# EAGLE design MRCS-4-Station-Tel-Control (EAGLE 7.7.0)
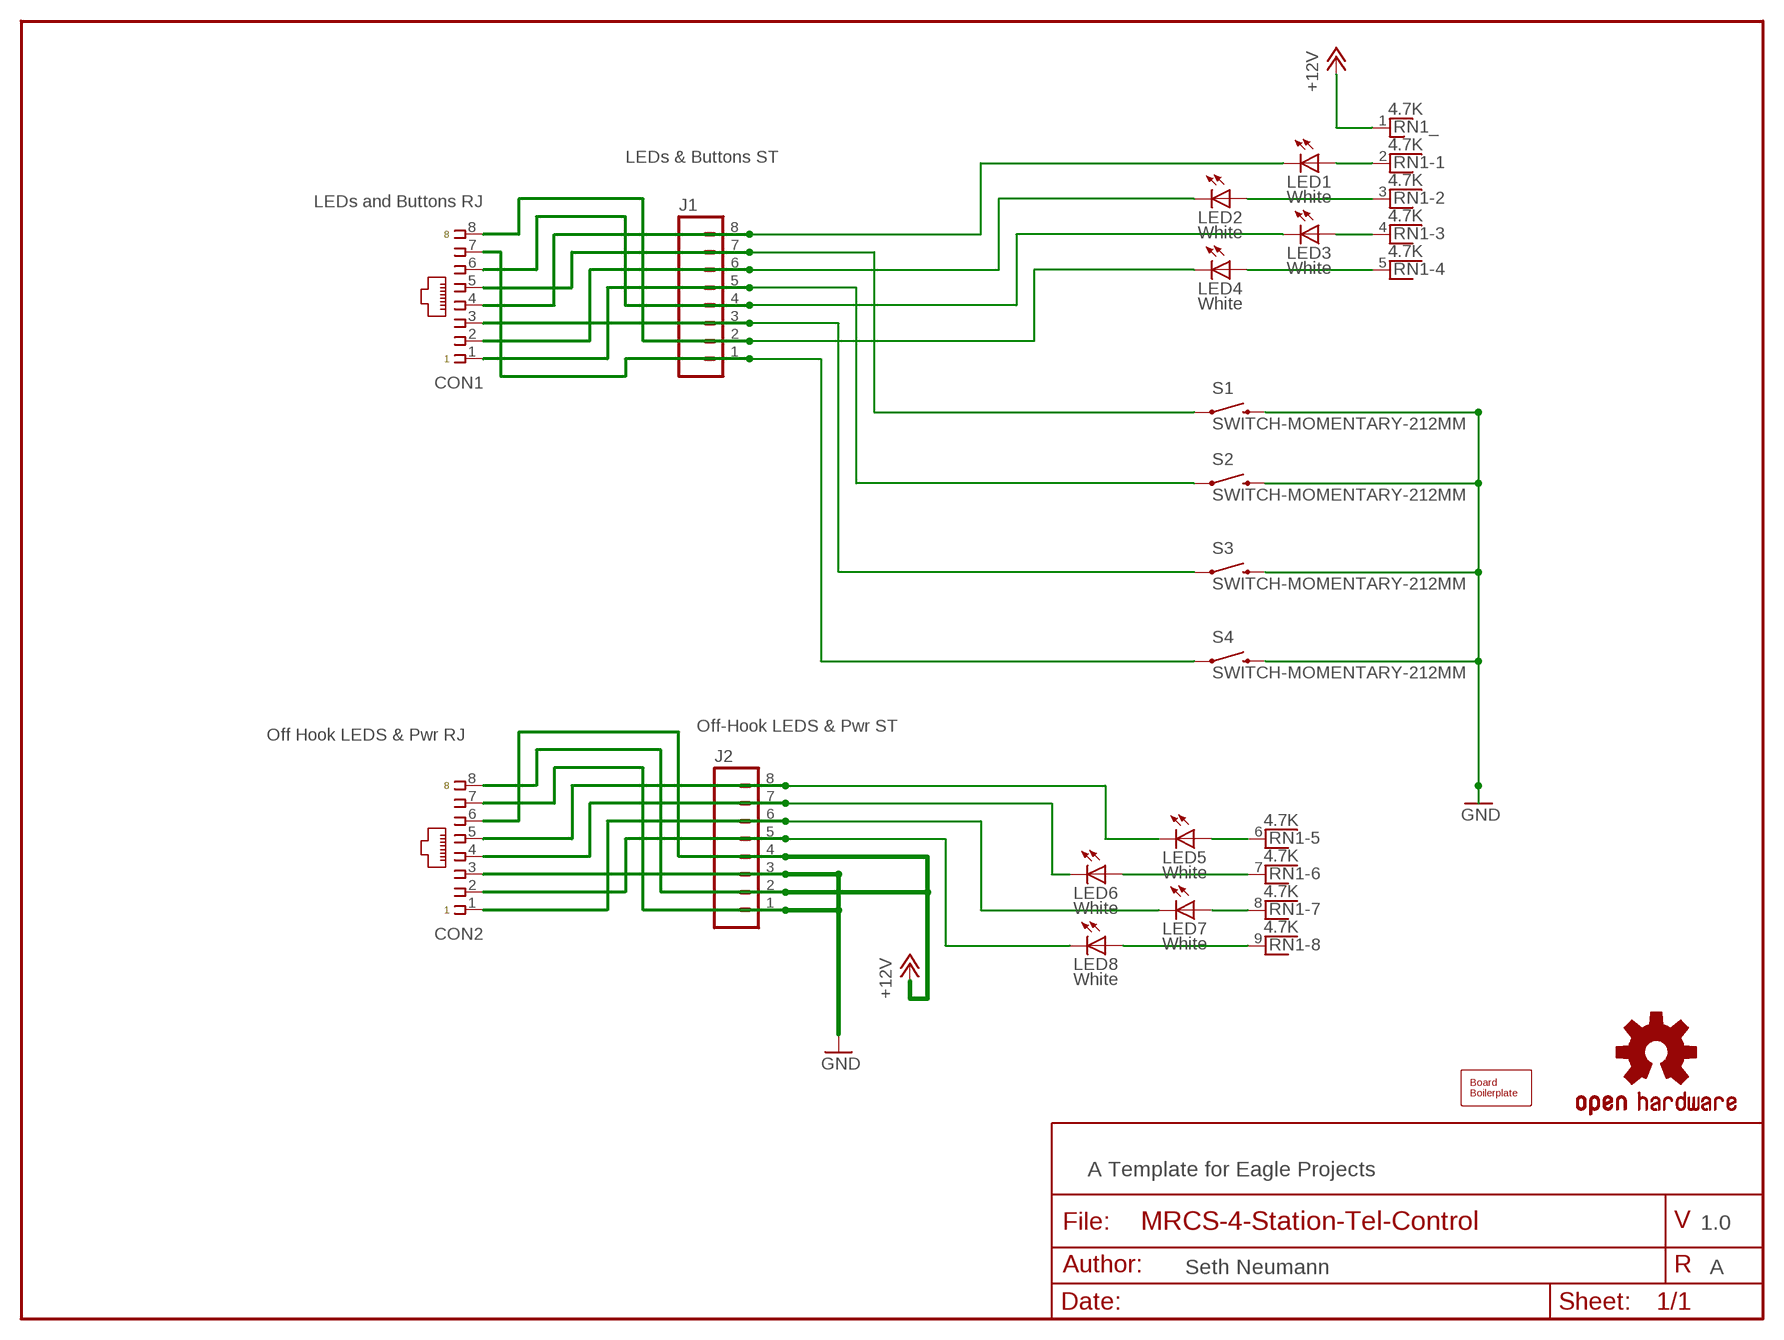
[diagram p0: schematic, sheet 1]

## Parts
BOARD1  BOARD80X100  [BOARD-DINRAIL-3.17INX10CM]
CON1  LEDs and Buttons RJ  CONNECTOR-RJ45-FRONT  [RJ45-NO-SHIELD]
CON2  Off Hook LEDS & Pwr RJ  CONNECTOR-RJ45-FRONT  [RJ45-NO-SHIELD]
J1  LEDs & Buttons ST  CONNECTOR-M08LOCK  [1X08_LOCK]
J2  Off-Hook LEDS & Pwr ST  CONNECTOR-M08LOCK  [1X08_LOCK]
LED1  White  LEDLED5MM  [LED5MM]
LED2  White  LEDLED5MM  [LED5MM]
LED3  White  LEDLED5MM  [LED5MM]
LED4  White  LEDLED5MM  [LED5MM]
LED5  White  LEDLED5MM  [LED5MM]
LED6  White  LEDLED5MM  [LED5MM]
LED7  White  LEDLED5MM  [LED5MM]
LED8  White  LEDLED5MM  [LED5MM]
OSHW1  DOC-OSHW-LOGO-M  [OSHW-LOGO-M]
RN1  4.7K  RNX8  [RN-9]
S1  SWITCH-MOMENTARY-212MM  [TACTILE-PTH-12MM]
S2  SWITCH-MOMENTARY-212MM  [TACTILE-PTH-12MM]
S3  SWITCH-MOMENTARY-212MM  [TACTILE-PTH-12MM]
S4  SWITCH-MOMENTARY-212MM  [TACTILE-PTH-12MM]

## Nets
+12V: CON2.6 CON2.8 J2.2 J2.4 RN1.1
GND: CON2.3 CON2.7 J2.1 J2.3 S1.3 S2.3 S3.3 S4.3
N$1: LED1.A RN1.2
N$2: LED2.A RN1.3
N$3: LED3.A RN1.4
N$4: LED4.A RN1.5
N$5: LED5.A RN1.6
N$6: LED6.A RN1.7
N$7: LED7.A RN1.8
N$8: LED8.A RN1.9
N$9: CON1.4 J1.8 LED1.K(C)
N$12: CON1.1 J1.5 S2.1
N$13: CON1.5 J1.7 S1.1
N$14: CON1.3 J1.3 S3.1
N$15: CON1.6 J1.4 LED3.K(C)
N$16: CON1.7 J1.1 S4.1
N$17: CON1.8 J1.2 LED4.K(C)
N$18: CON1.2 J1.6 LED2.K(C)
N$20: CON2.5 J2.8 LED5.K(C)
N$21: CON2.4 J2.7 LED6.K(C)
N$22: CON2.1 J2.6 LED7.K(C)
N$23: CON2.2 J2.5 LED8.K(C)

## Notes on the sheet
- A Template for Eagle Projects
- 1.0
- Seth Neumann | A

## Library data of the parts
BOARD1 = SPCoast:BOARD
CON1 CON2 = SPCoast:CONNECTOR-RJ45: Tyco CORCOM Modular RJ Jacks No Shield; AMP: 520151-4; OPL: none
J1 J2 = SPCoast:CONNECTOR-M08: Header 8 Standard 8-pin 0.1" header. Use with straight break away headers (SKU : PRT-00116), right angle break away headers (PRT-00553), swiss pins (PRT-00743), machine pins (PRT-00117), and female headers (PRT-00115).
LED1-LED8 = SPCoast:LED*
OSHW1 = SPCoast:DOC-OSHW-LOGO-: Open Source Hardware Logo This logo indicates the piece of hardware it is found on incorporates a OSHW license and/or adheres to the definition of open source hardware http://freedomdefined.org/OSHW Creative Commons - Attribution - ShareAlike 3.0
RN1 = resistor-net:RNX8: RESISTOR NETWORK; OC_FARNELL: unknown; OC_NEWARK: unknown
S1-S4 = SparkFun-Electromechanical:SWITCH-MOMENTARY-2: Various NO switches- pushbuttons, reed, etc; PROD_ID: SWCH-09185

## Board
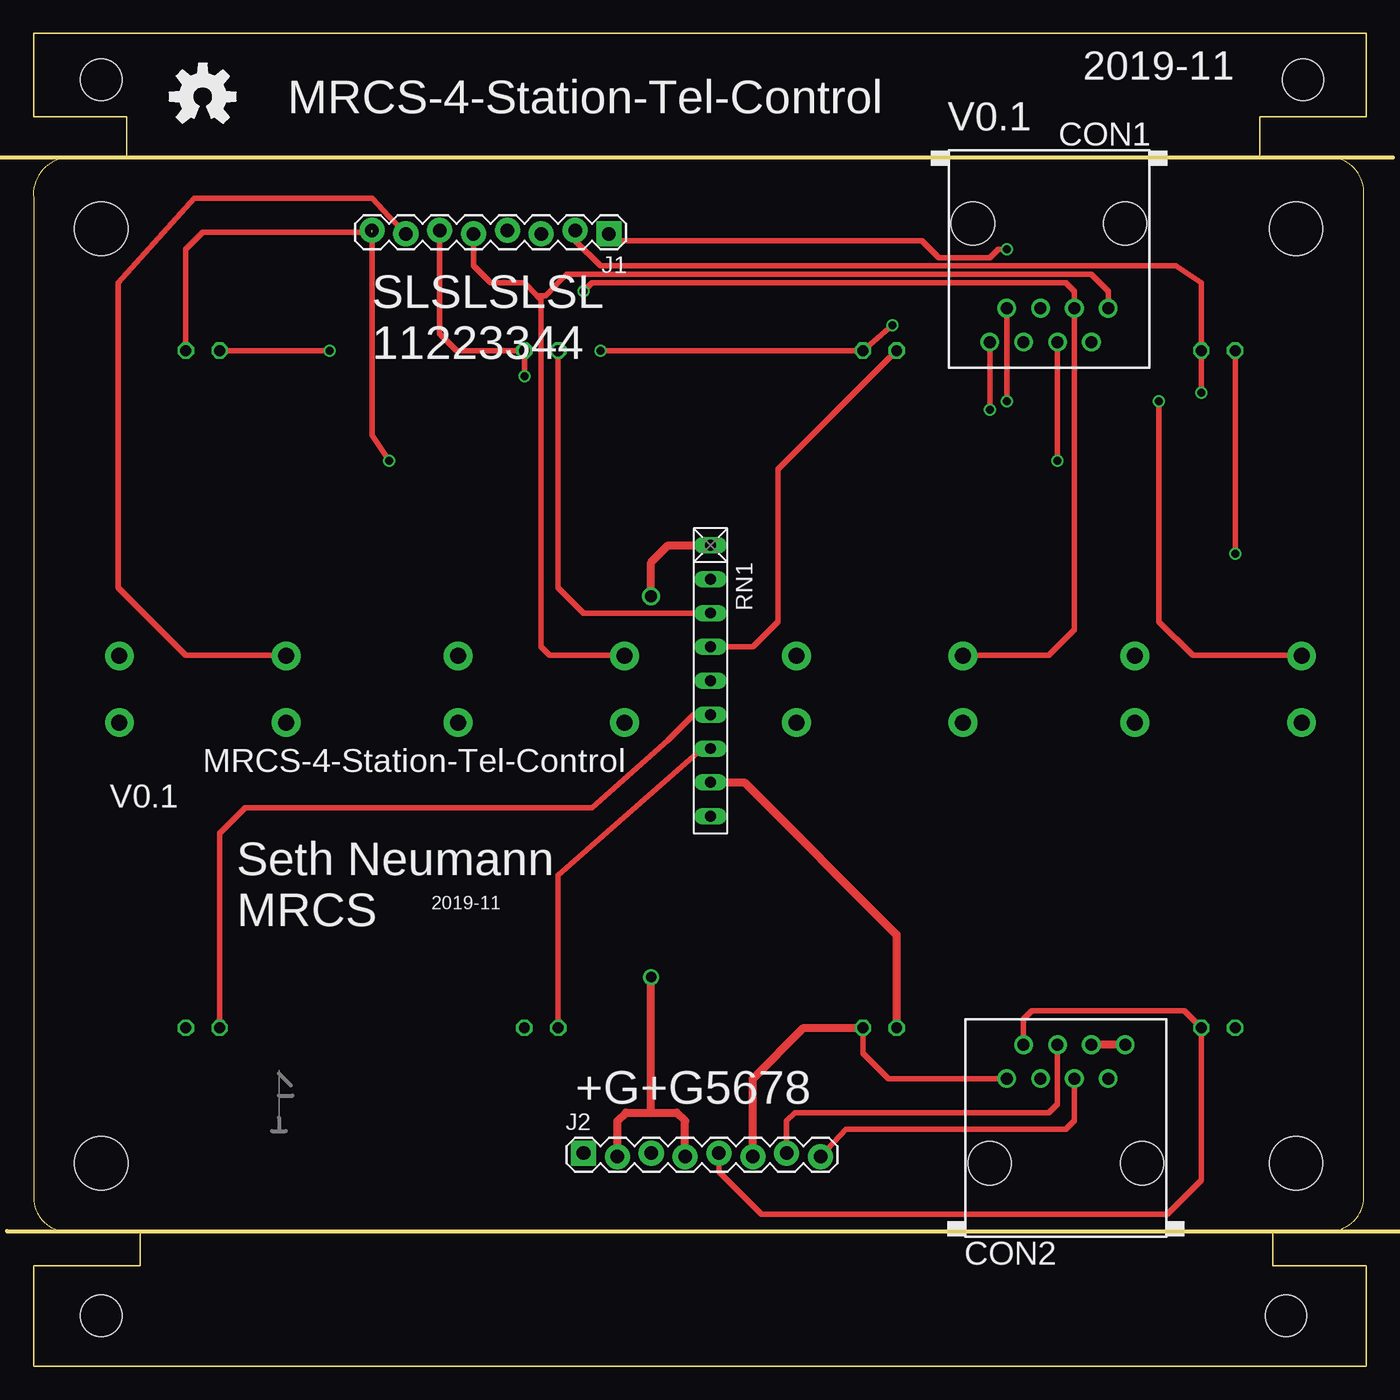
[diagram p1: board, top side]
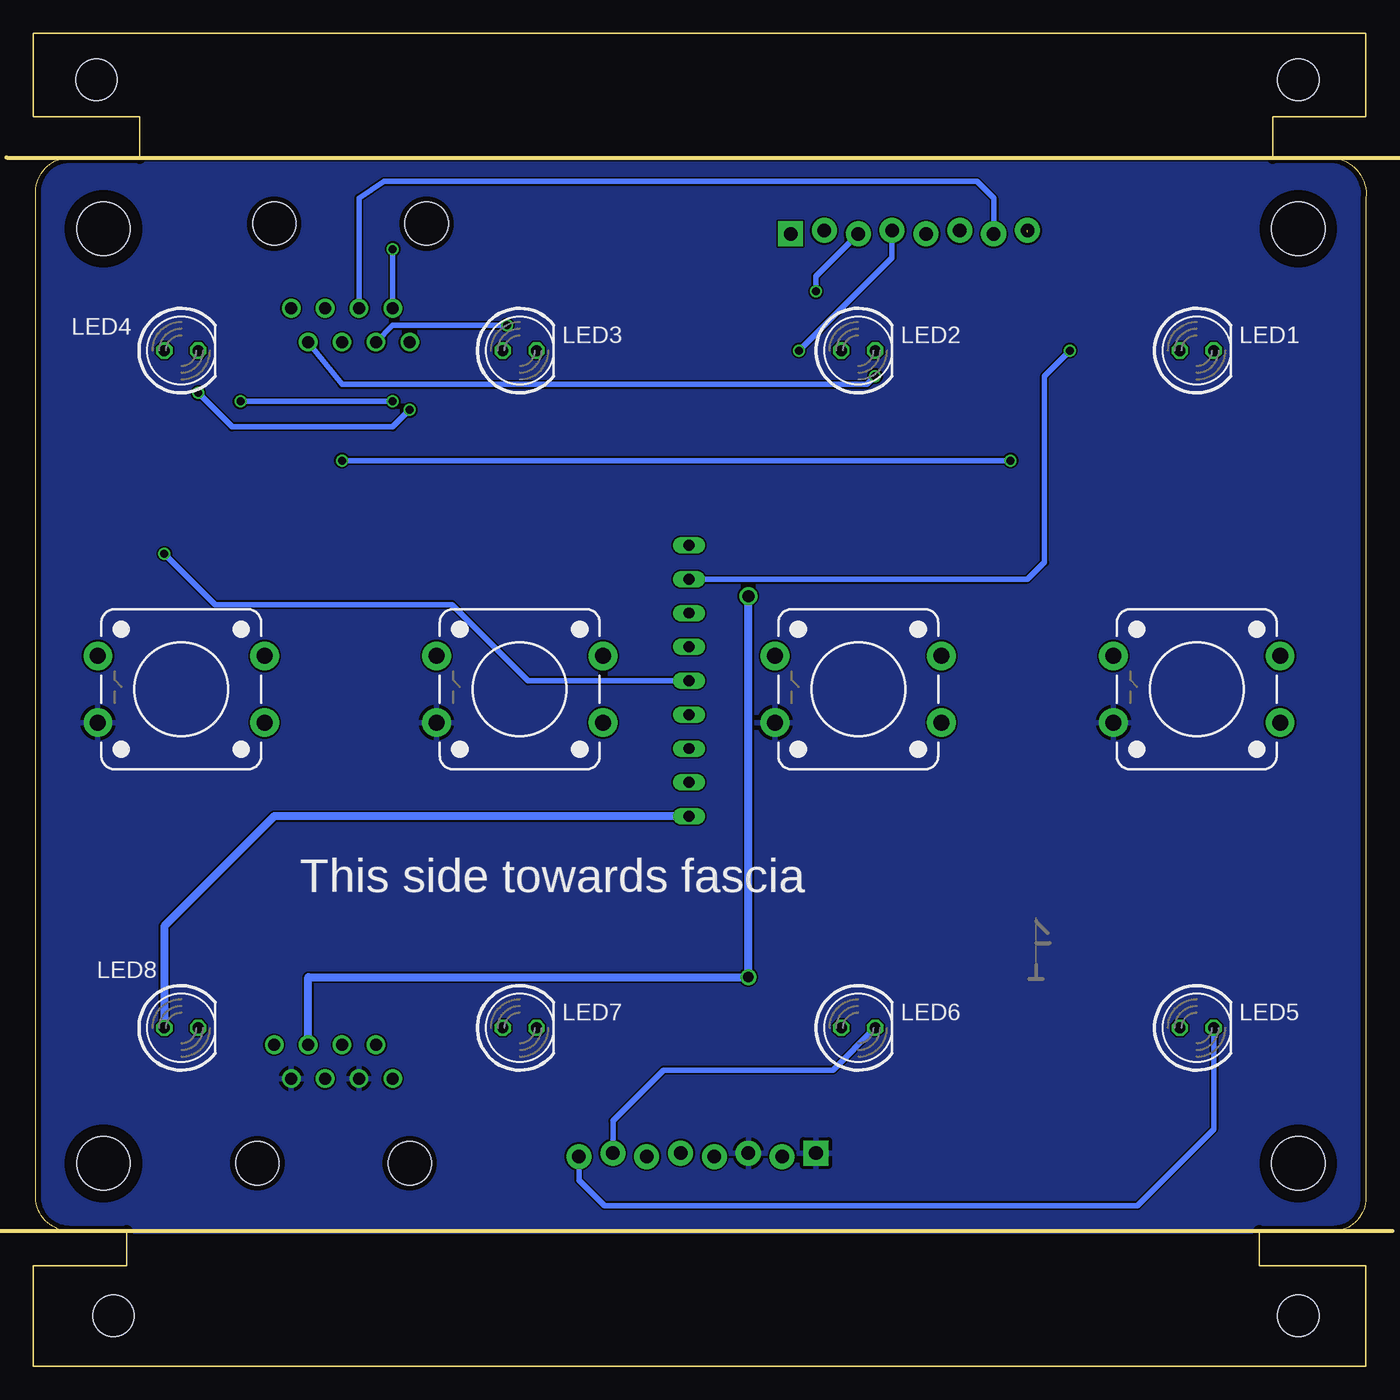
[diagram p2: board, bottom side, seen from below]

Size 100.01 x 100 mm. Coordinates in mm from the lower left corner, seen from the top.
Copper layers (1*16): Top 0.035mm / dielectric 1.5mm / Bottom 0.035mm
Design rules "default *": minimum track width 5mil, minimum drill 0.2mm, track to track 5mil, track to pad 5mil, pad to pad 5mil, via to via 5mil, smd to smd 5mil, copper to edge 0.4mm, drill to drill 5mil, minimum pad ring 3mil, minimum via ring 3mil, stop-mask expansion 4mil, vias tented up to drill 0mil, thermal gap 10mil

### Footprints (pad centres in the part's own frame; a part is rotated, then mirrored left to right if it is on the bottom)
BOARD-DINRAIL-3.17INX10CM = hole 4: 94.742,15.24; 5.08,85.344; 94.742,85.344; 5.08,15.24 | hole 3.1: 5.08,96.52; 95.25,96.52; 5.08,3.81; 93.98,3.81
RJ45-NO-SHIELD = drill 0.9 pad 1.4: 1 -4.445,6.35; 2 -3.175,8.89; 3 -1.905,6.35; 4 -0.635,8.89; 5 0.635,6.35; 6 1.905,8.89; 7 3.175,6.35; 8 4.445,8.89 | hole 3.251: -5.715,0; 5.715,0
1X08_LOCK = drill 1.016 pad 1.88 square: 1 0,0.127 | drill 1.016 pad 1.88: 2 2.54,-0.127; 3 5.08,0.127; 4 7.62,-0.127; 5 10.16,0.127; 6 12.7,-0.127; 7 15.24,0.127; 8 17.78,-0.127
LED5MM = drill 0.813 octagon: A 1.27,0; K -1.27,0
RN-9 = drill 0.813 long: 1 -10.16,0; 2 -7.62,0; 3 -5.08,0; 4 -2.54,0; 5 0,0; 6 2.54,0; 7 5.08,0; 8 7.62,0; 9 10.16,0
TACTILE-PTH-12MM = drill 1.2 pad 2.159: 1 6.25,-2.5; 2 -6.25,-2.5; 3 6.25,2.5; 4 -6.25,2.5

### Placement (x,y rotation side)
BOARD1  0.01,0 0 top
CON1  76.21,85.72 180 top
CON2  77.48,15.24 0 top
J1  43.19,85.09 180 top
J2  41.29,15.88 0 top
LED1  12.71,76.2 180 bottom
LED2  38.11,76.2 180 bottom
LED3  63.51,76.2 180 bottom
LED4  88.91,76.2 180 bottom
LED5  12.71,25.4 180 bottom
LED6  38.11,25.4 180 bottom
LED7  63.51,25.4 180 bottom
LED8  88.91,25.4 180 bottom
OSHW1  12.71,95.25 0 top
RN1  50.81,51.44 270 top
S1  12.71,50.8 180 bottom
S2  38.11,50.8 180 bottom
S3  63.51,50.8 180 bottom
S4  88.91,50.8 180 bottom
U$1  [MRCSLOGOTOP]  17.16,17.14 0 top
U$2  [CA-PROP65WARNING]  74.31,63.5 0 top
U$3  [MRCSLOGOBTM]  18.43,28.57 0 top

### Tracks (layer width: path | path; a pad name or v marks a point on that pad's centre or on a via)
+12V  (via drill 0.8, 0.9)
  Top 0.61: J2.2 43.83,18.41 44.46,19.05 46.37,19.05 | 46.37,19.05 48.27,19.05 48.91,18.41 J2.4 | 46.37,19.05 v46.37,29.21 | v46.37,57.78 46.37,60.33 47.64,61.59 RN1.1 | CON2.8 CON2.6
  Bottom 0.61: v46.37,57.78 v46.37,29.21 79.39,29.21 CON2.6
GND
  pour Bottom: 0.01,10.16 99.71,10.16 99.71,90.17 0.65,90.17 0.01,90.81
N$1  (via drill 0.6)
  Top 0.406: v22.24,76.2 LED1.A
  Bottom 0.406: RN1.2 25.41,59.05 24.14,60.33 24.14,74.3 v22.24,76.2
N$2
  Top 0.406: LED2.A 39.38,58.42 41.29,56.52 RN1.3
N$3
  Top 0.406: RN1.4 53.99,53.98 55.89,55.88 55.89,67.31 LED3.A
N$4  (via drill 0.6)
  Top 0.406: v90.18,60.96 LED4.A
  Bottom 0.406: RN1.5 62.88,51.44 68.59,57.15 86.37,57.15 v90.18,60.96
N$5
  Top 0.406: LED5.A 13.98,40.01 15.89,41.91 41.92,41.91 47.64,46.99 49.54,48.9 RN1.6
N$6
  Top 0.406: LED6.A 39.38,36.83 50.18,46.35 RN1.7
N$7
  Top 0.61: RN1.8 53.35,43.81 64.78,32.38 LED7.A
N$8
  Bottom 0.61: RN1.9 81.93,41.27 90.18,33.02 LED8.A
N$9  (via drill 0.6)  (1 unrouted)
  Top 0.406: LED1.K 11.44,83.82 12.71,85.09 25.41,85.09 25.41,69.85 v26.68,67.94 | v76.85,67.94 CON1.4
  Bottom 0.406: v26.68,67.94 v76.85,67.94
N$12
  Top 0.406: 37.8,80.33 38.11,80.01 38.11,53.98 38.75,53.34 44.32,53.34 S2.1 | 37.8,80.33 36.84,81.28 34.3,81.28 33.03,82.55 J1.5 | 37.8,80.33 38.43,80.33 40.02,81.92 79.39,81.92 80.66,80.64 CON1.1
N$13
  Top 0.406: J1.7 26.68,86.23 25.41,87.63 12.08,87.63 6.36,81.28 6.36,58.42 11.44,53.34 18.92,53.34 S1.1
  Bottom 0.406: CON1.5 75.58,87.63 73.67,88.9 29.22,88.9 27.95,87.63 J1.7
N$14  (via drill 0.6)
  Top 0.406: v41.29,80.64 41.92,81.28 77.48,81.28 78.12,80.64 CON1.3 78.12,55.24 76.21,53.34 69.8,53.34 S3.1
  Bottom 0.406: v41.29,80.64 41.29,81.79 J1.3
N$15  (via drill 0.6)
  Top 0.406: v42.56,76.2 LED3.K v64.47,78.11
  Bottom 0.406: J1.4 35.57,83.19 v42.56,76.2 | CON1.6 73.04,78.11 v64.47,78.11
N$16  (via drill 0.6)
  Top 0.406: J1.1 43.7,84.45 66.69,84.45 67.96,83.19 71.77,83.19 72.4,83.82 v73.04,83.82 | v73.04,72.39 CON1.7 | v84.47,72.39 84.47,55.88 87.01,53.34 95.12,53.34 S4.1
  Bottom 0.406: v73.04,83.82 CON1.7 | v84.47,72.39 v73.04,72.39
N$17  (via drill 0.6)
  Top 0.406: J1.2 40.65,84.45 42.56,82.55 85.74,82.55 87.64,81.28 LED4.K v87.64,73.03 | CON1.8 v71.77,71.75
  Bottom 0.406: v87.64,73.03 85.1,70.48 73.04,70.48 v71.77,71.75
N$18  (via drill 0.6)
  Top 0.406: J1.6 30.49,77.47 31.76,76.2 LED2.K v36.84,74.3
  Bottom 0.406: CON1.2 76.85,73.66 37.48,73.66 v36.84,74.3
N$20
  Top 0.406: J2.8 60.97,17.78 77.48,17.78 78.12,18.41 CON2.5
  Bottom 0.406: LED5.K 11.44,17.78 17.16,12.06 57.16,12.06 59.07,13.97 J2.8
N$21
  Top 0.406: CON2.4 76.85,19.68 76.21,19.05 57.16,19.05 56.53,18.41 J2.7
  Bottom 0.406: LED6.K 40.02,22.23 52.72,22.23 56.53,18.41 J2.7
N$22
  Top 0.406: CON2.1 64.15,21.59 62.24,23.5 LED7.K
  Top 0.61: J2.6 53.99,21.59 57.8,25.4 LED7.K
N$23
  Top 0.406: J2.5 51.45,14.61 54.62,11.43 85.1,11.43 87.64,13.97 LED8.K 86.37,26.67 74.94,26.67 74.31,26.04 CON2.2

### Text on the board
tPlace: 2019-11 | V0.1 | SLSLSLSL / 11223344 | V0.1 | 2019-11 | Seth Neumann / MRCS | +G+G5678
bPlace: This side towards fascia
Document: Use tPlace/bPlace for silkscreen text and drawings / Use Document, tDocu and bDocu for assembly notes and documentation that does NOT go on the board